# EAGLE design main (EAGLE 9.6.2)
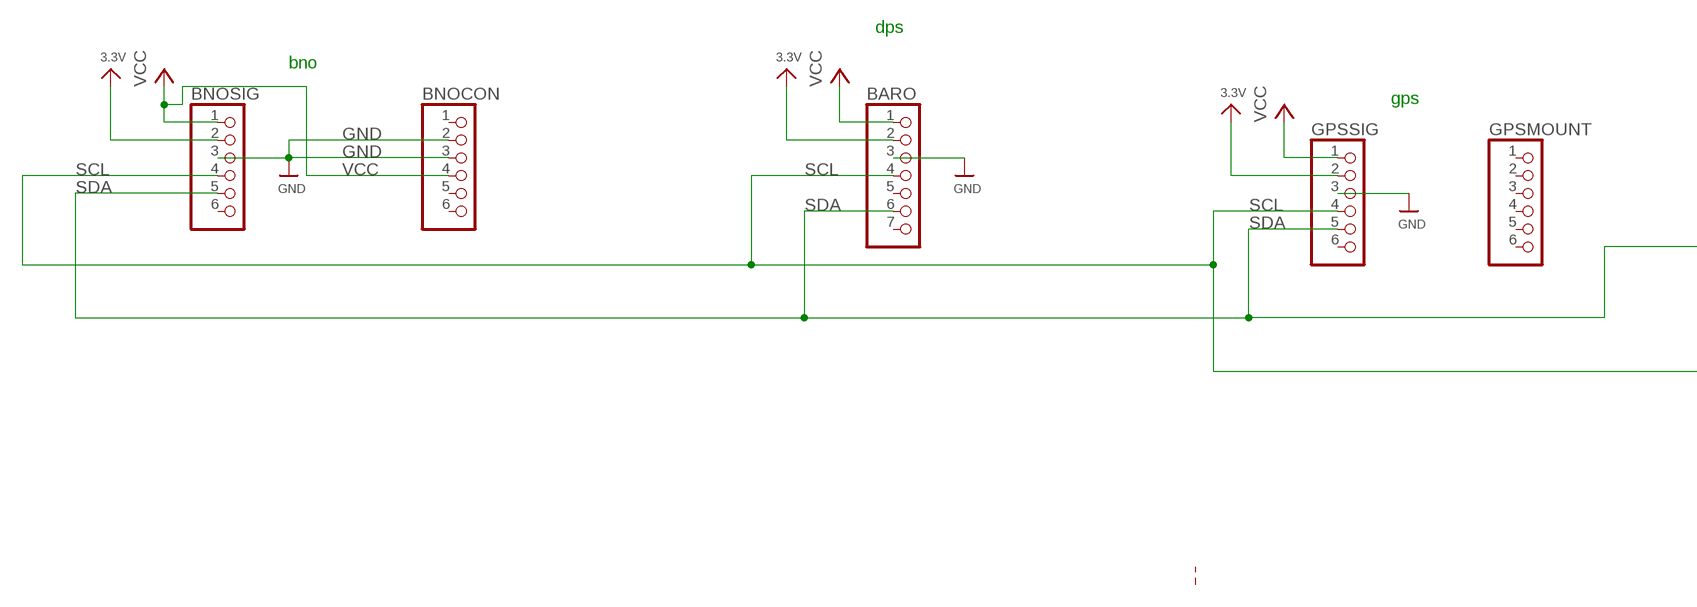
[diagram p0: schematic, sheet 1, part 1 of 2]
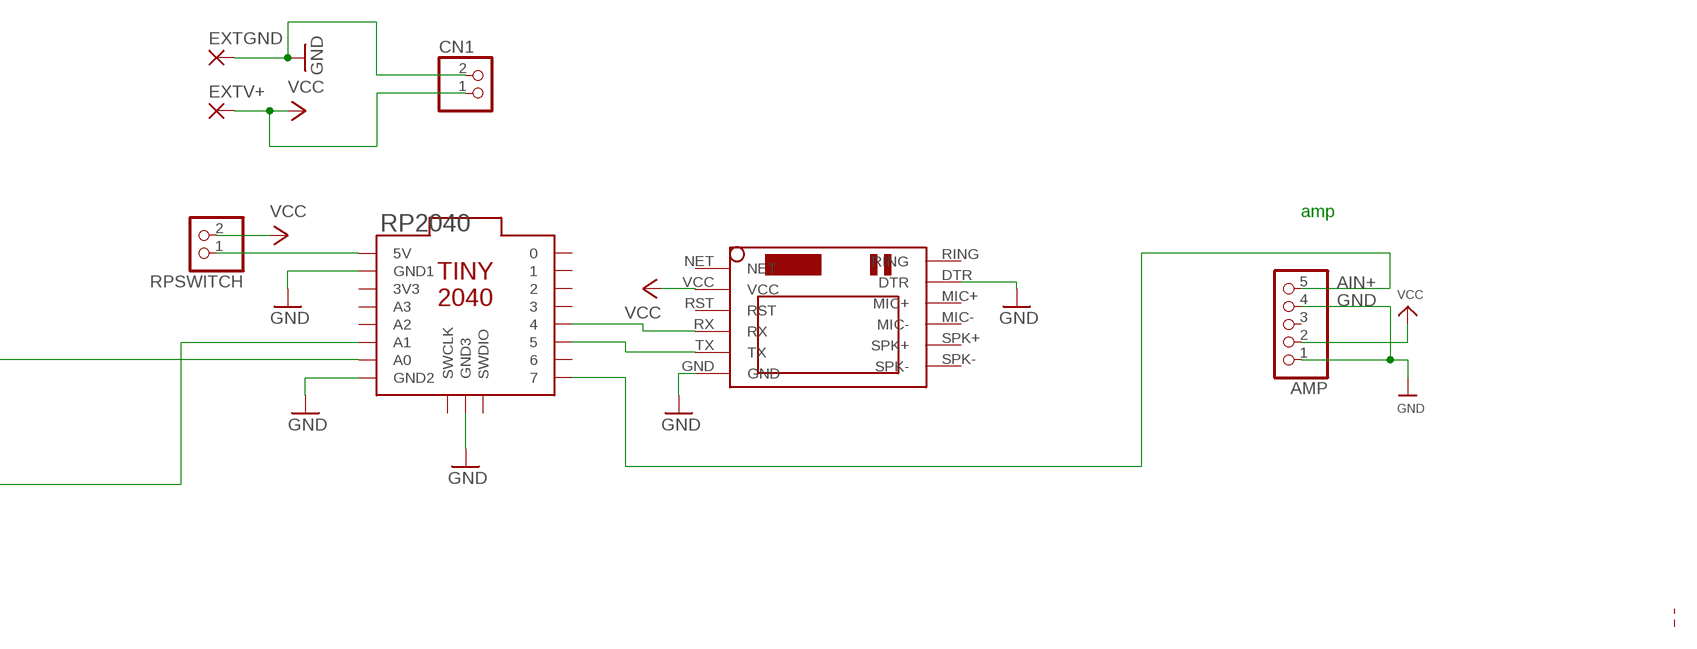
[diagram p1: schematic, sheet 1, part 2 of 2]

## Parts
AMP  HEADER-1X570MIL  [1X05_ROUND_70]
BARO  HEADER-1X770MIL  [1X07_ROUND_70]
BNOCON  HEADER-1X670MIL  [1X06_ROUND_70]
BNOSIG  HEADER-1X670MIL  [1X06_ROUND_70]
CN1  JST_2PIN-THM-RA  [JST-PH-2-THM-RA]
EXTGND  SMD5  [SMD2,54-5,08]
EXTV+  SMD5  [SMD2,54-5,08]
GPSMOUNT  HEADER-1X670MIL  [1X06_ROUND_70]
GPSSIG  HEADER-1X670MIL  [1X06_ROUND_70]
RP2040  TINY2040  [TINY2040]
RPSWITCH  PINHD-1X2  [1X02]
U$1  SIM800LMODULE  [SIM800LMODULE]

## Nets
3.3V [lowpower]: BARO.2 BNOSIG.2 GPSSIG.2
AIN+: AMP.5 RP2040.7
GND [lowpower]: AMP.1 AMP.4 BARO.3 BNOCON.2 BNOCON.3 BNOSIG.3 CN1.2 EXTGND.1(P) GPSSIG.3 RP2040.GND1 RP2040.GND2 RP2040.GND3 U$1.DTR U$1.GND
N$1: RP2040.4 U$1.RX
N$2: RP2040.5 U$1.TX
N$3: RP2040.5V RPSWITCH.1
SCL: BARO.4 BNOSIG.4 GPSSIG.4 RP2040.A1
SDA: BARO.6 BNOSIG.5 GPSSIG.5 RP2040.A0
VCC [lowpower]: AMP.2 BARO.1 BNOCON.4 BNOSIG.1 CN1.1 EXTV+.1(P) GPSSIG.1 RPSWITCH.2 U$1.VCC
Unconnected: AMP.3 BARO.5 BARO.7 BNOCON.1 BNOCON.5 BNOCON.6 BNOSIG.6 GPSMOUNT.1 GPSMOUNT.2 GPSMOUNT.3 GPSMOUNT.4 GPSMOUNT.5 GPSMOUNT.6 GPSSIG.6 RP2040.0 RP2040.1 RP2040.2 RP2040.3 RP2040.3V3 RP2040.6 RP2040.A2 RP2040.A3 RP2040.SWCLK RP2040.SWDIO U$1.MIC+ U$1.MIC- U$1.NET U$1.RING U$1.RST U$1.SPK+ U$1.SPK-

## Notes on the sheet
- dps
- bno
- gps | amp

## Library data of the parts
AMP = microbuilder:HEADER-1X5: PIN HEADER
BARO = microbuilder:HEADER-1X7: PIN HEADER
BNOCON BNOSIG GPSMOUNT GPSSIG = microbuilder:HEADER-1X6: PIN HEADER
CN1 = adafruit:JST_2PIN: JST 2-Pin Connectors of various flavors SMT-RA (S2B-PH-SM4) 4UConnector #17311 SMT (B2B-PH-SM4) THM-RA (S2B-PH) THM (B2B-PH)
EXTGND EXTV+ = wirepad:SMD5: SMD PAD
RP2040 = pimoroni-boards:TINY2040
RPSWITCH = pinhead:PINHD-1X2: PIN HEADER
U$1 = SIM800LMODULE:SIM800LMODULE: SIM800L Module

## Net classes
1 highpower: width 0.305 mm, drill 0.483 mm
2 lowpower: width 0.254 mm, drill 0.381 mm

## Board
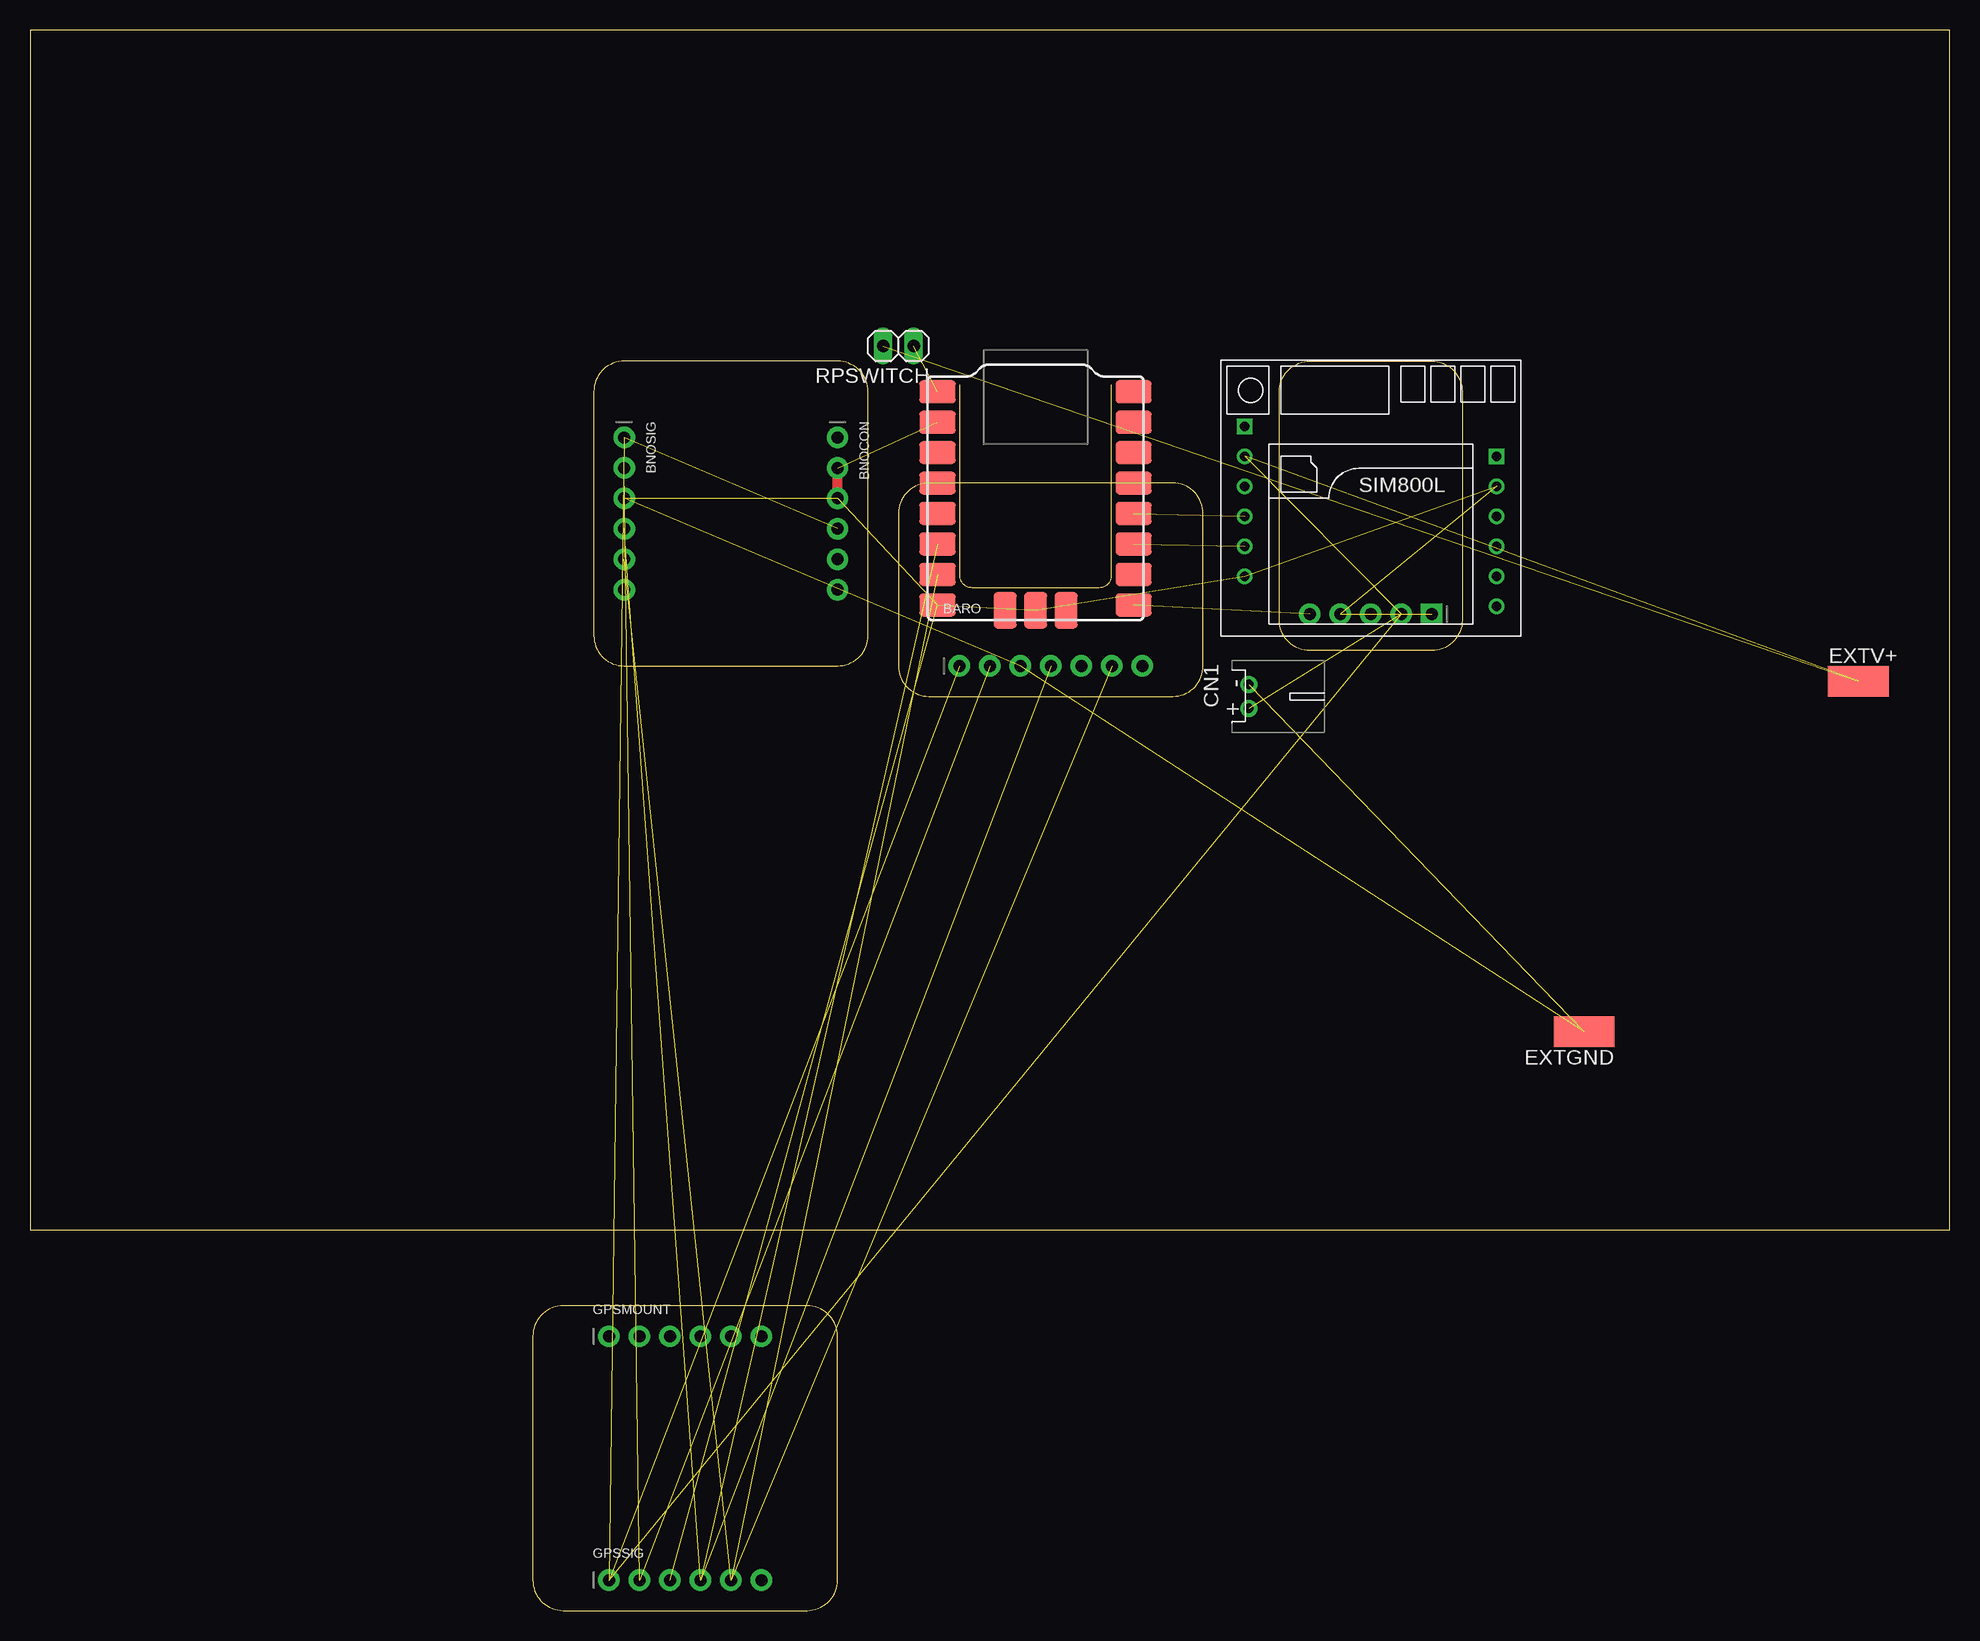
[diagram p2: board, top side]

Size 160 x 131.75 mm. Coordinates in mm from the lower left corner, seen from the top.
Outline: 0,31.75 160,31.75 160,131.75 0,131.75 0,31.75
Outline: 116.84,80.01 106.68,80.01 arc-90 104.14,82.55 104.14,101.6 arc-90 106.68,104.14 116.84,104.14 arc-90 119.38,101.6 119.38,82.55 arc-90 116.84,80.01
Outline: 41.91,22.86 41.91,2.54 arc90 44.45,0 64.77,0 arc90 67.31,2.54 67.31,22.86 arc90 64.77,25.4 44.45,25.4 arc90 41.91,22.86
Outline: 72.39,91.44 72.39,78.74 arc90 74.93,76.2 95.25,76.2 arc90 97.79,78.74 97.79,91.44 arc90 95.25,93.98 74.93,93.98 arc90 72.39,91.44
Outline: 67.31,104.14 49.53,104.14 arc90 46.99,101.6 46.99,81.28 arc90 49.53,78.74 67.31,78.74 arc90 69.85,81.28 69.85,101.6 arc90 67.31,104.14
Copper layers (1*16): Top 0.035mm / dielectric 1.5mm / Bottom 0.035mm
Design rules "default": minimum track width 6mil, minimum drill 0.35mm, track to track 6mil, track to pad 6mil, pad to pad 6mil, via to via 6mil, smd to smd 6mil, copper to edge 40mil, drill to drill 6mil, minimum pad ring 10mil, minimum via ring 8mil, stop-mask expansion 4mil, vias tented up to drill 0mil, thermal gap 10mil

### Footprints (pad centres in the part's own frame; a part is rotated, then mirrored left to right if it is on the bottom)
1X05_ROUND_70 = drill 1 pad 1.778 square: 1 -5.08,0 | drill 1 pad 1.778: 2 -2.54,0; 3 0,0; 4 2.54,0; 5 5.08,0
1X07_ROUND_70 = drill 1 pad 1.778: 1 -7.62,0; 2 -5.08,0; 3 -2.54,0; 4 0,0; 5 2.54,0; 6 5.08,0; 7 7.62,0
1X06_ROUND_70 = drill 1 pad 1.778: 1 -6.35,0; 2 -3.81,0; 3 -1.27,0; 4 1.27,0; 5 3.81,0; 6 6.35,0
JST-PH-2-THM-RA = drill 0.8 pad 1.422: 1 1,0; 2 -1,0
SMD2,54-5,08 = smd 2.54 x 5.08: 1 0,0
TINY2040 = smd 1.9 x 3: 0 1.27,8.17; 1 3.81,8.17; 2 6.35,8.17; 3 8.89,8.17; 3V3 6.35,-8.17; 4 11.43,8.17; 5 13.97,8.17; 5V 1.27,-8.17; 6 16.51,8.17; 7 19.05,8.17; A0 16.51,-8.17; A1 13.97,-8.17; A2 11.43,-8.17; A3 8.89,-8.17; GND1 3.81,-8.17; GND2 19.05,-8.17 | smd 3 x 1.9: GND3 19.49,0; SWCLK 19.49,-2.54; SWDIO 19.49,2.54
1X02 = drill 1.016 long: 1 -1.27,0; 2 1.27,0
SIM800LMODULE = drill 0.8: DTR 10.5,1; GND -10.5,-6.5; MIC+ 10.5,-1.5; MIC- 10.5,-4; RST -10.5,1; RX -10.5,-1.5; SPK+ 10.5,-6.5; SPK- 10.5,-9; TX -10.5,-4; VCC -10.5,3.5 | drill 0.8 square: NET -10.5,6; RING 10.5,3.5

### Placement (x,y rotation side)
AMP  111.76,83.06 180 top
BARO  85.09,78.74 0 top
BNOCON  67.31,91.44 270 top
BNOSIG  49.53,91.44 270 top
CN1  101.6,76.2 270 top
EXTGND  129.54,48.26 90 top
EXTV+  152.4,77.47 270 top
GPSMOUNT  54.61,22.86 0 top
GPSSIG  54.61,2.54 0 top
RP2040  83.82,102.87 270 top
RPSWITCH  72.39,105.41 180 top
U$1  111.76,92.71 0 top

### Tracks (layer width: path | path; a pad name or v marks a point on that pad's centre or on a via)
3.3V  (2 unrouted)
AIN+  (1 unrouted)
GND  (12 unrouted)
  Top 0.813: BNOCON.3 BNOCON.2
N$1  (1 unrouted)
N$2  (1 unrouted)
N$3  (1 unrouted)
SCL  (3 unrouted)
SDA  (3 unrouted)
VCC  (8 unrouted)